# Altium schematic sheet AnalogSensor.SchDoc
size A
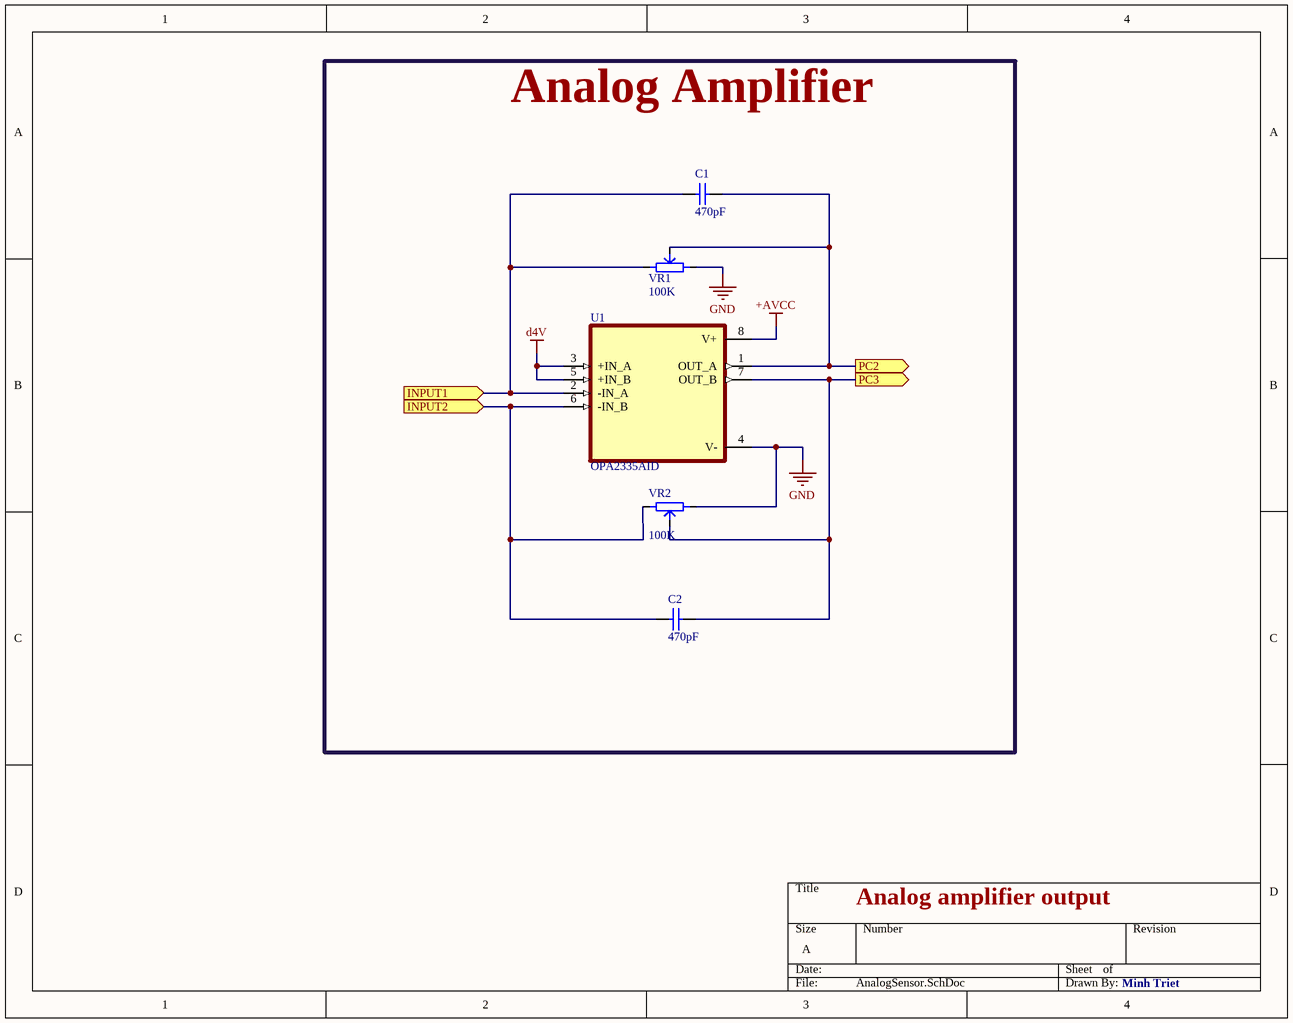
[diagram p0: AnalogSensor.SchDoc]

## Parts
C1  470pF  [tu 0603]
C2  470pF  [tu 0603]
U1  OPA2335AID  [SOIC127P599X175-8N]
VR1  100K  [Bien Tro Tam Giac Dung]
VR2  100K  [Bien Tro Tam Giac Dung]

## Blocks framed on the sheet
Analog Amplifier: C1 C2 U1 VR1 VR2

## Ports
INPUT1 (in), INPUT2 (in), PC2 (out), PC3 (out)

## Nets
+AVCC: U1.8(V+)
d4V: U1.3(+IN_A) U1.5(+IN_B)
GND: U1.4(V-) VR1.3 VR2.1
INPUT1: C1.2 U1.2(-IN_A) VR1.1 ; port INPUT1
INPUT2: C2.2 U1.6(-IN_B) VR2.3 ; port INPUT2
PC2: C1.1 U1.1(OUT_A) VR1.2 ; port PC2
PC3: C2.1 U1.7(OUT_B) VR2.2 ; port PC3

## Notes on the sheet
- Analog amplifier output
- Minh Triet

## Library data of the parts
C1 C2 = Tu 0603 470pF 50V 10%: Dán; Don_Vi: Con; So_Chan: 2; Ten_Linh_Kien: Tụ 0603 470P 50V 10%; Ma_Hang: MH004571; Chung_Loai: Dán; Kieu_Chan: *
U1 = OPA2335AID: MF: {'manufacturer': u'Texas Instruments'}; Package: None; Price: None; Value: *; MP: OPA2335AID; Availability: Unavailable
VR1 VR2 = Bien tro tam giac 100K Dung: Cắm; Don_Vi: Con; Ten_Linh_Kien: Biến Trở Tam Giác 104-100K RM065; Ma_Hang: MH003711; Chung_Loai: Cắm; Ghi_Chu: *; Kieu_Chan: *